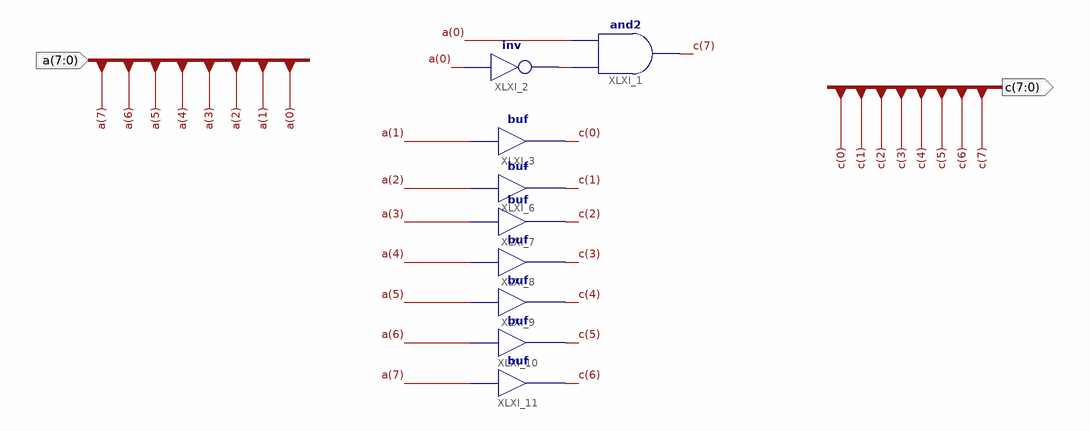
[diagram p0: schematic sheet 1]
// Xilinx ISE schematic shift.sch (spartan6) as structural Verilog: 9 symbols, 2 ports
module shift (
  input  [7:0] a,
  output [7:0] c
);

  wire XLXN_11;

  and XLXI_1 (c[7], XLXN_11, a[0]);
  not XLXI_2 (XLXN_11, a[0]);
  buf XLXI_3 (c[0], a[1]);
  buf XLXI_6 (c[1], a[2]);
  buf XLXI_7 (c[2], a[3]);
  buf XLXI_8 (c[3], a[4]);
  buf XLXI_9 (c[4], a[5]);
  buf XLXI_10 (c[5], a[6]);
  buf XLXI_11 (c[6], a[7]);
endmodule
